# Altium schematic sheet 08_SERIAL & USER INTERF.SchDoc
size 420 x 297 mm
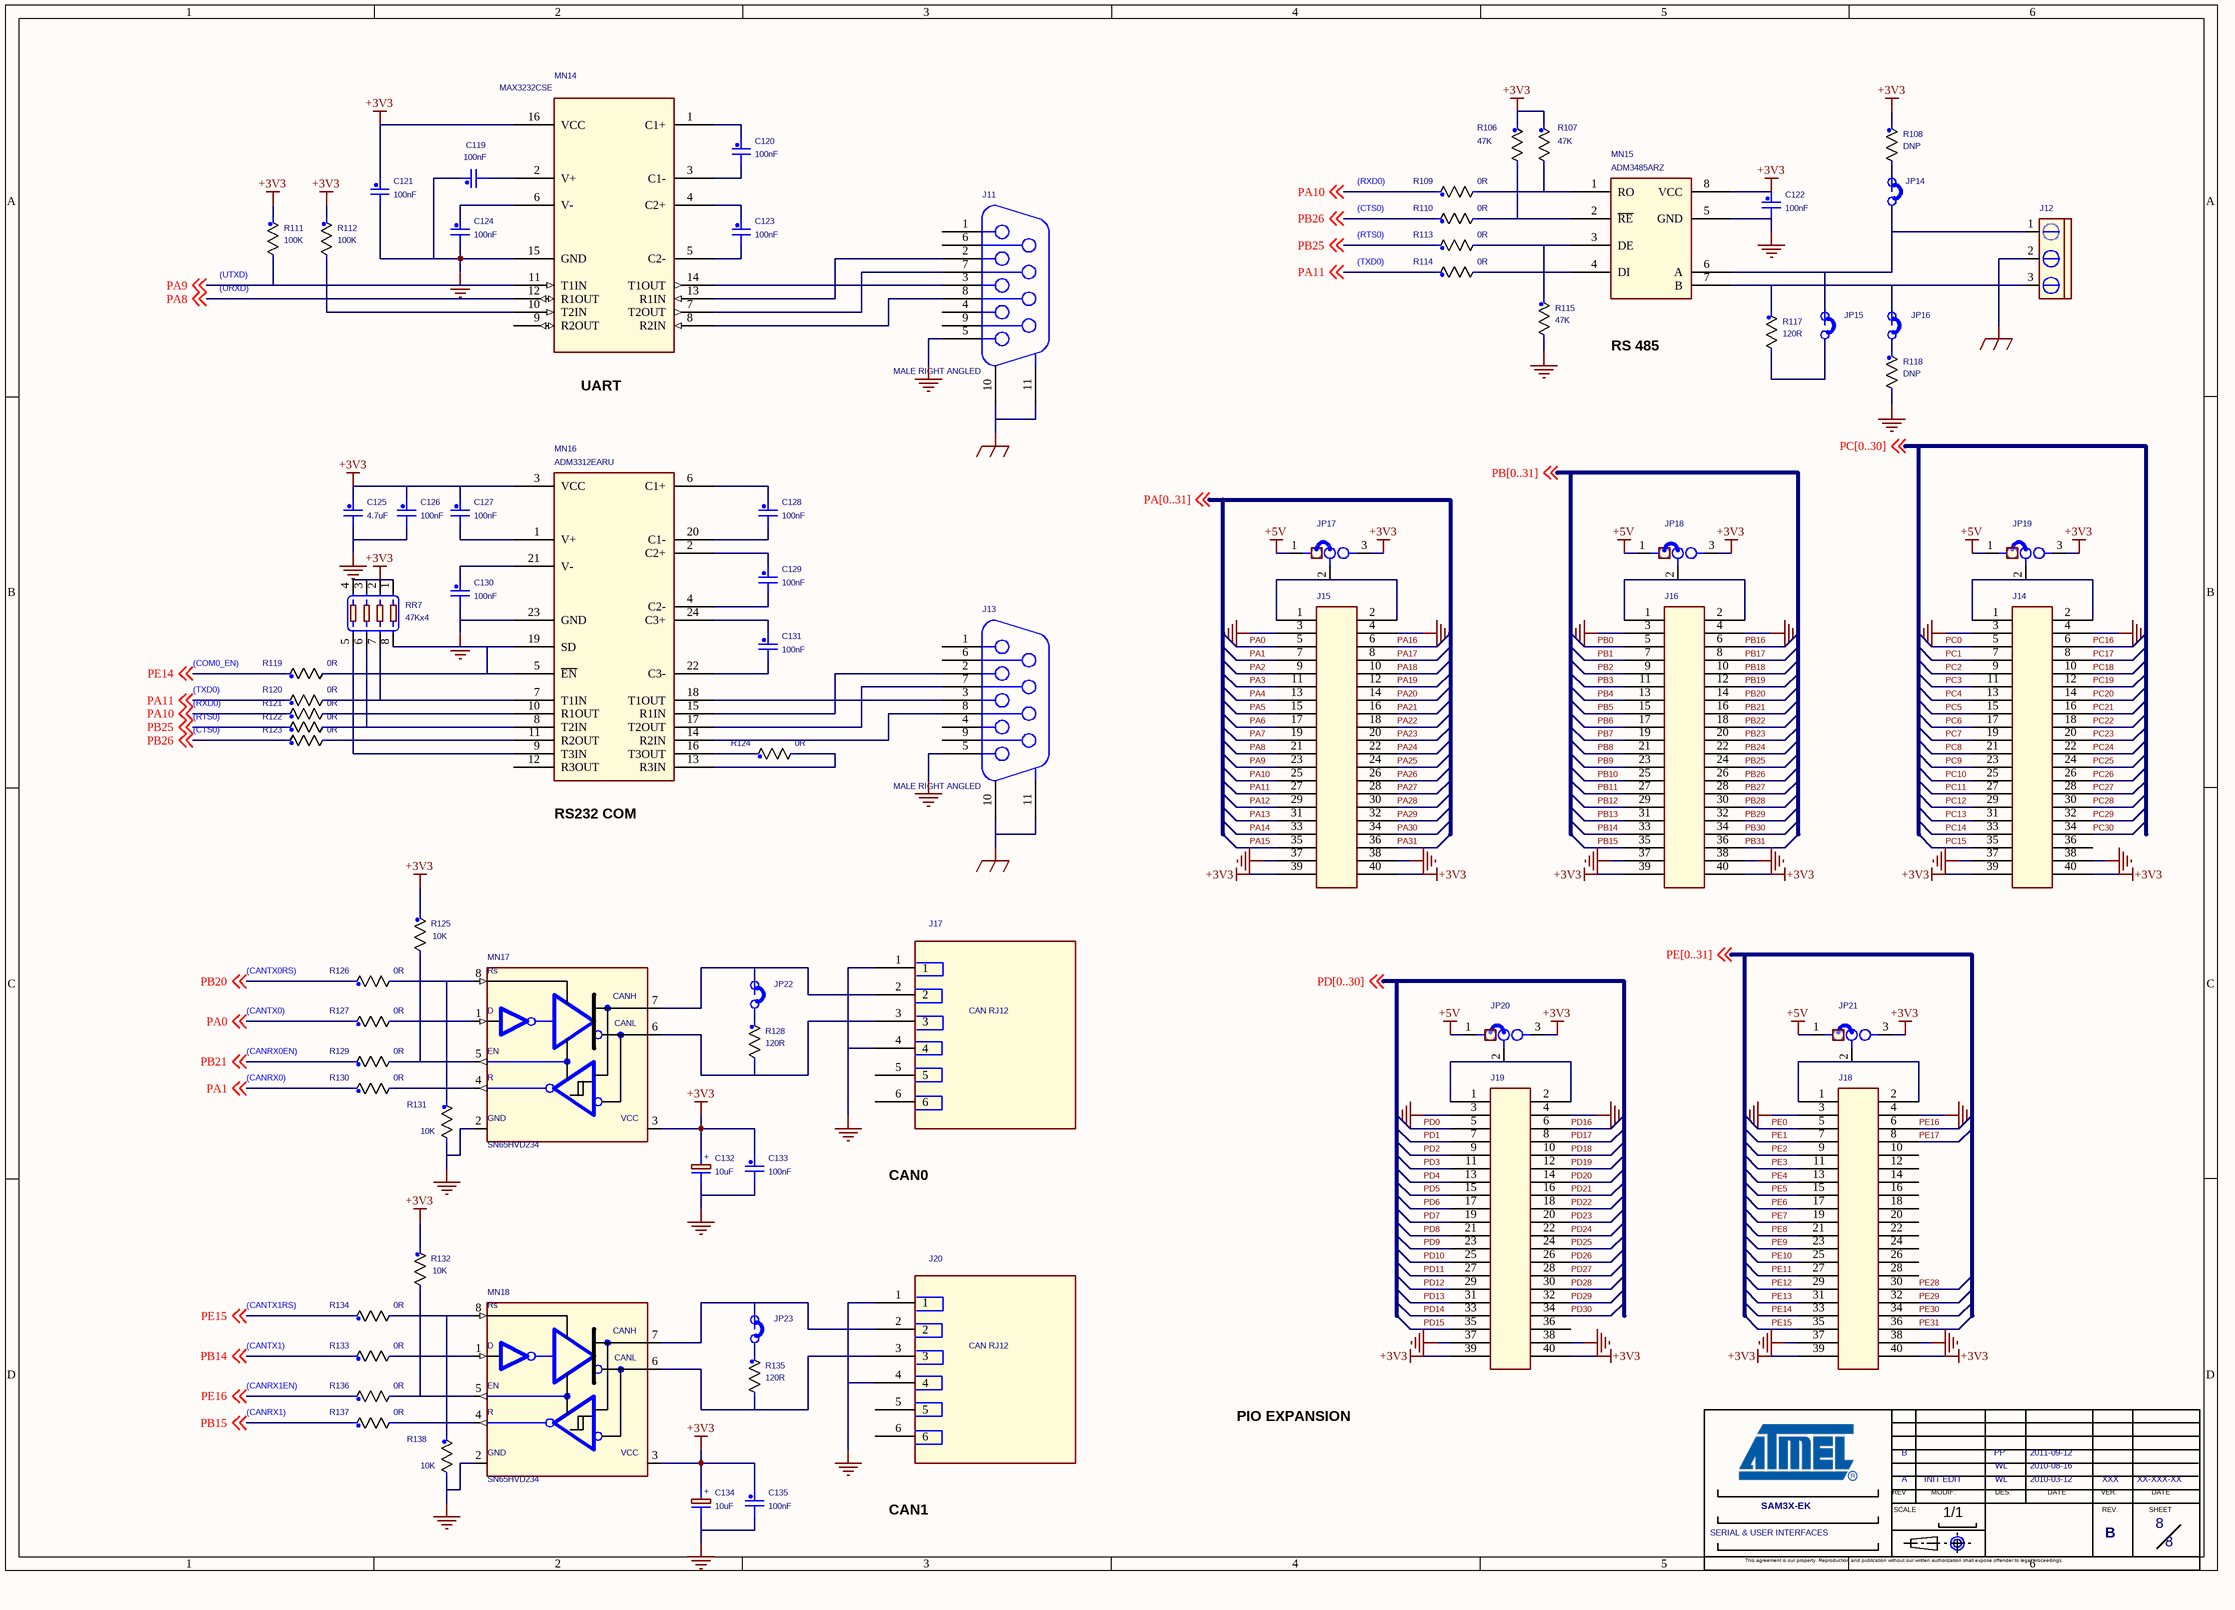
[diagram p0: 08_SERIAL & USER INTERF.SchDoc]

## Parts
*  SHEET NAME 1: SERIAL & USER INTERFACES  REV C: B  VERIF A: XXX  VERIF DATE A: XX-XXX-XX  Page Count: 8  DATE A: 2010-03-12  DATE B: 2010-08-16  DATE C: 2011-09-12  DES A: WL  DES C: PP  BOARD NAME: SAM3X-EK  VERSION: A  MODIF. DESCRIBE: INIT EDIT  (hidden comment: ATMEL ARM)  (graphical)
C119  100nF  [CAP0805]
C120  100nF  [CAP0805]
C121  100nF  [CAP0805]
C122  100nF  [CAP0805]
C123  100nF  [CAP0805]
C124  100nF  [CAP0805]
C125  4.7uF  [CAP0805]
C126  100nF  [CAP0805]
C127  100nF  [CAP0805]
C128  100nF  [CAP0805]
C129  100nF  [CAP0805]
C130  100nF  [CAP0805]
C131  100nF  [CAP0805]
C132  10uF  [C3216-18]
C133  100nF  [CAP0805]
C134  10uF  [C3216-18]
C135  100nF  [CAP0805]
J11  VAL: MALE RIGHT ANGLED  [SUBD9M_H_C]  (hidden comment: SUBD9_M_COUDE)
J12  7143-035S  [7143-035s]  (value not drawn)
J13  VAL: MALE RIGHT ANGLED  [SUBD9M_H_C]  (hidden comment: SUBD9_M_COUDE)
J14  048  [jms_tsm-2x20pts]  (value not drawn)
J15  048  [jms_tsm-2x20pts]  (value not drawn)
J16  048  [jms_tsm-2x20pts]  (value not drawn)
J17  CAN RJ12  [RJ12-55503]
J18  048  [jms_tsm-2x20pts]  (value not drawn)
J19  048  [jms_tsm-2x20pts]  (value not drawn)
J20  CAN RJ12  [RJ12-55503]
JP14  JP  [BAR2PTS02]  (value not drawn)
JP15  JP  [BAR2PTS02]  (value not drawn)
JP16  JP  [BAR2PTS02]  (value not drawn)
JP17  header3-100  [BAR3PTS02]  (value not drawn)
JP18  header3-100  [BAR3PTS02]  (value not drawn)
JP19  header3-100  [BAR3PTS02]  (value not drawn)
JP20  header3-100  [BAR3PTS02]  (value not drawn)
JP21  header3-100  [BAR3PTS02]  (value not drawn)
JP22  JP  [BAR2PTS02]  (value not drawn)
JP23  JP  [BAR2PTS02]  (value not drawn)
MN14  MAX3232CSE  [so16]
MN15  ADM3485ARZ  [so8]
MN16  ADM3312EARU  [tssop24]
MN17  SN65HVD234  [SO08]
MN18  SN65HVD234  [SO08]
R106  47K  [R0603]
R107  47K  [R0603]
R108  DNP  [r0603]
R109  0R  [r0603]
R110  0R  [r0603]
R111  100K  [r0603]
R112  100K  [r0603]
R113  0R  [r0603]
R114  0R  [r0603]
R115  47K  [R0603]
R117  120R  [r0603]
R118  DNP  [r0603]
R119  0R  [r0603]
R120  0R  [r0603]
R121  0R  [r0603]
R122  0R  [r0603]
R123  0R  [r0603]
R124  0R  [r0603]
R125  10K  [R0603]
R126  0R  [r0603]
R127  0R  [r0603]
R128  120R  [r0603]
R129  0R  [r0603]
R130  0R  [r0603]
R131  10K  [R0603]
R132  10K  [R0603]
R133  0R  [r0603]
R134  0R  [r0603]
R135  120R  [r0603]
R136  0R  [r0603]
R137  0R  [r0603]
R138  10K  [R0603]
RR7  47Kx4  [RESP4R]
SH20  Jumper Pitch 2.54  [JUMPER-2.54]  (value not drawn)
SH21  Jumper Pitch 2.54  [JUMPER-2.54]  (value not drawn)
SH22  Jumper Pitch 2.54  [JUMPER-2.54]  (value not drawn)
SH23  Jumper Pitch 2.54  [JUMPER-2.54]  (value not drawn)
SH24  Jumper Pitch 2.54  [JUMPER-2.54]  (value not drawn)
SH25  Jumper Pitch 2.54  [JUMPER-2.54]  (value not drawn)
SH26  Jumper Pitch 2.54  [JUMPER-2.54]  (value not drawn)
SH27  Jumper Pitch 2.54  [JUMPER-2.54]  (value not drawn)
SH28  Jumper Pitch 2.54  [JUMPER-2.54]  (value not drawn)
SH29  Jumper Pitch 2.54  [JUMPER-2.54]  (value not drawn)

## Nets
+3V3: C121.1 C122.1 C125.1 C126.1 C127.1 C132.1 C133.1 C134.1 C135.1 J14.39 J14.40 J15.39 J15.40 J16.39 J16.40 J18.39 J18.40 J19.39 J19.40 JP17.3 JP18.3 JP19.3 JP20.3 JP21.3 MN14.16(VCC) MN15.8(VCC) MN16.3(VCC) MN17.3(VCC) MN18.3(VCC) R106.1 R107.1 R108.1 R111.1 R112.1 R125.1 R132.1 RR7.1 RR7.2 RR7.3 RR7.4
+5V: JP17.1 JP18.1 JP19.1 JP20.1 JP21.1
GND_EARTH: J11.10(M1) J11.11(M2) J12.2 J13.10(M1) J13.11(M2)
GND_POWER: C119.1 C121.2 C122.2 C124.2 C125.2 C126.2 C130.2 C132.2 C133.2 C134.2 C135.2 J11.5 J13.5 J14.3 J14.4 J14.37 J14.38 J15.3 J15.4 J15.37 J15.38 J16.3 J16.4 J16.37 J16.38 J17.1 J17.4 J18.3 J18.4 J18.37 J18.38 J19.3 J19.4 J19.37 J19.38 J20.1 J20.4 MN14.15(GND) MN15.5(GND) MN16.23(GND) MN17.2(GND) MN18.2(GND) R115.2 R118.2 R131.2 R138.2
PA0: J15.5 R127.1 ; off-sheet PA0
PA1: J15.7 R130.1 ; off-sheet PA1
PA2: J15.9
PA3: J15.11
PA4: J15.13
PA5: J15.15
PA6: J15.17
PA7: J15.19
PA8: J15.21 MN14.12(R1OUT) ; off-sheet PA8
PA9: J15.23 MN14.11(T1IN) R111.2 ; off-sheet PA9
PA10: J15.25 R109.1 R121.1 ; off-sheet PA10
PA11: J15.27 R114.1 R120.1 ; off-sheet PA11
PA12: J15.29
PA13: J15.31
PA14: J15.33
PA15: J15.35
PA16: J15.6
PA17: J15.8
PA18: J15.10
PA19: J15.12
PA20: J15.14
PA21: J15.16
PA22: J15.18
PA23: J15.20
PA24: J15.22
PA25: J15.24
PA26: J15.26
PA27: J15.28
PA28: J15.30
PA29: J15.32
PA30: J15.34
PA31: J15.36
PB0: J16.5
PB1: J16.7
PB2: J16.9
PB3: J16.11
PB4: J16.13
PB5: J16.15
PB6: J16.17
PB7: J16.19
PB8: J16.21
PB9: J16.23
PB10: J16.25
PB11: J16.27
PB12: J16.29
PB13: J16.31
PB14: J16.33 R133.1 ; off-sheet PB14
PB15: J16.35 R137.1 ; off-sheet PB15
PB16: J16.6
PB17: J16.8
PB18: J16.10
PB19: J16.12
PB20: J16.14 R126.1 ; off-sheet PB20
PB21: J16.16 R129.1 ; off-sheet PB21
PB22: J16.18
PB23: J16.20
PB24: J16.22
PB25: J16.24 R113.1 R122.1 ; off-sheet PB25
PB26: J16.26 R110.1 R123.1 ; off-sheet PB26
PB27: J16.28
PB28: J16.30
PB29: J16.32
PB30: J16.34
PB31: J16.36
PC0: J14.5
PC1: J14.7
PC2: J14.9
PC3: J14.11
PC4: J14.13
PC5: J14.15
PC6: J14.17
PC7: J14.19
PC8: J14.21
PC9: J14.23
PC10: J14.25
PC11: J14.27
PC12: J14.29
PC13: J14.31
PC14: J14.33
PC15: J14.35
PC16: J14.6
PC17: J14.8
PC18: J14.10
PC19: J14.12
PC20: J14.14
PC21: J14.16
PC22: J14.18
PC23: J14.20
PC24: J14.22
PC25: J14.24
PC26: J14.26
PC27: J14.28
PC28: J14.30
PC29: J14.32
PC30: J14.34
PD0: J19.5
PD1: J19.7
PD2: J19.9
PD3: J19.11
PD4: J19.13
PD5: J19.15
PD6: J19.17
PD7: J19.19
PD8: J19.21
PD9: J19.23
PD10: J19.25
PD11: J19.27
PD12: J19.29
PD13: J19.31
PD14: J19.33
PD15: J19.35
PD16: J19.6
PD17: J19.8
PD18: J19.10
PD19: J19.12
PD20: J19.14
PD21: J19.16
PD22: J19.18
PD23: J19.20
PD24: J19.22
PD25: J19.24
PD26: J19.26
PD27: J19.28
PD28: J19.30
PD29: J19.32
PD30: J19.34
PE0: J18.5
PE1: J18.7
PE2: J18.9
PE3: J18.11
PE4: J18.13
PE5: J18.15
PE6: J18.17
PE7: J18.19
PE8: J18.21
PE9: J18.23
PE10: J18.25
PE11: J18.27
PE12: J18.29
PE13: J18.31
PE14: J18.33 R119.1 ; off-sheet PE14
PE15: J18.35 R134.1 ; off-sheet PE15
PE16: J18.6 R136.1 ; off-sheet PE16
PE17: J18.8
PE28: J18.30
PE29: J18.32
PE30: J18.34
PE31: J18.36
NetC119_2: C119.2 MN14.2(V+)
NetC120_1: C120.1 MN14.1(C1+)
NetC120_2: C120.2 MN14.3(C1-)
NetC123_1: C123.1 MN14.4(C2+)
NetC123_2: C123.2 MN14.5(C2-)
NetC124_1: C124.1 MN14.6(V-)
NetC127_2: C127.2 MN16.1(V+)
NetC128_1: C128.1 MN16.6(C1+)
NetC128_2: C128.2 MN16.20(C1-)
NetC129_1: C129.1 MN16.2(C2+)
NetC129_2: C129.2 MN16.4(C2-)
NetC130_1: C130.1 MN16.21(V-)
NetC131_1: C131.1 MN16.24(C3+)
NetC131_2: C131.2 MN16.22(C3-)
NetJ11_2: J11.2 MN14.13(R1IN)
NetJ11_3: J11.3 MN14.14(T1OUT)
NetJ11_7: J11.7 MN14.7(T2OUT)
NetJ11_8: J11.8 MN14.8(R2IN)
NetJ12_1: J12.1 JP14.2 JP15.1 MN15.6(A)
NetJ12_3: J12.3 JP16.1 MN15.7(B) R117.1
NetJ13_2: J13.2 MN16.15(R1IN)
NetJ13_3: J13.3 MN16.18(T1OUT)
NetJ13_7: J13.7 MN16.17(T2OUT)
NetJ13_8: J13.8 MN16.14(R2IN)
NetJ14_1: J14.1 J14.2 JP19.2
NetJ15_1: J15.1 J15.2 JP17.2
NetJ16_1: J16.1 J16.2 JP18.2
NetJ17_2: J17.2 JP22.1 MN17.7(CANH)
NetJ17_3: J17.3 MN17.6(CANL) R128.2
NetJ18_1: J18.1 J18.2 JP21.2
NetJ19_1: J19.1 J19.2 JP20.2
NetJ20_2: J20.2 JP23.1 MN18.7(CANH)
NetJ20_3: J20.3 MN18.6(CANL) R135.2
NetJP14_1: JP14.1 R108.2
NetJP15_2: JP15.2 R117.2
NetJP16_2: JP16.2 R118.1
NetJP22_2: JP22.2 R128.1
NetJP23_2: JP23.2 R135.1
NetMN14_10: MN14.10(T2IN) R112.2
NetMN15_1: MN15.1(RO) R107.2 R109.2
NetMN15_2: MN15.2(~{RE}) R106.2 R110.2
NetMN15_3: MN15.3(DE) R113.2 R115.1
NetMN15_4: MN15.4(DI) R114.2
NetMN16_5: MN16.5(~{EN}) MN16.19(SD) R119.2 RR7.8
NetMN16_7: MN16.7(T1IN) R120.2 RR7.7
NetMN16_8: MN16.8(T2IN) R122.2 RR7.6
NetMN16_9: MN16.9(T3IN) RR7.5
NetMN16_10: MN16.10(R1OUT) R121.2
NetMN16_11: MN16.11(R2OUT) R123.2
NetMN16_13: MN16.13(R3IN) R124.2
NetMN16_16: MN16.16(T3OUT) R124.1
NetMN17_1: MN17.1(TXD) R127.2
NetMN17_4: MN17.4(RXD) R130.2
NetMN17_5: MN17.5(VREF) R125.2 R129.2
NetMN17_8: MN17.8(RS) R126.2 R131.1
NetMN18_1: MN18.1(TXD) R133.2
NetMN18_4: MN18.4(RXD) R137.2
NetMN18_5: MN18.5(VREF) R132.2 R136.2
NetMN18_8: MN18.8(RS) R134.2 R138.1

Not connected (* = marked no-connect by the designer): J11 1 4 6 9; J13 1 4 6 9; J14 36; J17 5 6; J18 10 12 14 16 18 20 22 24 26 28; J19 36; J20 5 6; MN14 9(R2OUT); MN16 12(R3OUT)

## Notes on the sheet
- (RXD0)
- (RTS0)
- (CTS0)
- (near R111) (UTXD)
- (near R111) (URXD)
- (TXD0)
- UART
- RS 485
- (COM0_EN)
- (near MN16) RS232 COM
- (CANTX0RS)
- (CANTX0)
- (CANRX0EN)
- (CANRX0)
- CAN0
- (CANTX1RS)
- (CANRX1EN)
- (CANTX1)
- (CANRX1)
- PIO EXPANSION
- CAN1
- (in symbol ATMEL ARM) REV; MODIF.; DES.; DATE; VER.; SCALE; REV.; SHEET; 1/1; This agreement is our property. Reproduction and publication without our written authorization shall expose offender to legal proceedings.
- (in symbol CAP_PN) +
- (in symbol SN65HVD234 SO8) Rs; D; EN; R

## Library data of the parts
* = ATMEL ARM: REV D: D; REV F: F; REV E: E; REV B: B; VERIF F: XXX; VERIF E: XXX; VERIF D: XXX; VERIF C: XXX; VERIF B: XXX; VERIF DATE F: XX-XXX-XX; VERIF DATE E: XX-XXX-XX; VERIF DATE D: XX-XXX-XX; VERIF DATE C: XX-XXX-XX; REV: B; VERIF DATE B: XX-XXX-XX; FT: ?; Page Number: 8; Page Size: A; Page Create Date: june 19, 2004; DATE D: XX-XXX-XX; DATE E: XX-XXX-XX; DATE F: XX-XXX-XX; DES E: XXX; DES F: XXX; DES B: WL; DES D: XXX
C119 C121 C123 C127 C128 C131 C133 C135 = C_Generic: Toler.: 10%; P/N #1: C0603C104K4RAC; Voltage: 16V; Mfg #1: KEMET; Dielectric: X7R; REF: C1608X7R1C104KT; FAB: TDK; DEV: C0603; DESIG: Ceramic Capacitor; BOI: 0603; TOL: 10%; TEN: 16V; VAL: 100nF
C120 C122 C124 C126 C129 C130 = C_Generic: Toler.: 10%; P/N #1: C0603C104K4RAC; Voltage: 16V; Mfg #1: KEMET; Dielectric: X7R; BOI: 0603; DESIG: Ceramic Capacitor; DEV: C0603; FAB: TDK; REF: C1608X7R1C104KT; VAL: 100nF; TEN: 16V; TOL: 10%
C125 = C_Generic: Toler.: 10%; P/N #1: C0603C104K4RAC; Voltage: 16V; Mfg #1: KEMET; Dielectric: X5R; BOI: 0805; DESIG: X5R CERAMIC CAPACITOR; DEV: C0805; FAB: TDK; REF: C2012X5R1C475KT; VAL: 4.7uF; TEN: 16V; TOL: 10%
C132 C134 = CAP_PN: SDTSourceLibName: C:\WINDOWS\TEMP\SNDS.LIB; BOI: A; DESIG: LOW ESR TANTALUM CAPACITOR; DEV: 3216; FAB: AVX; REF: TPSA106K010R1800; TEN: 10V; TOL: 10%; Dielectric: X5R; VAL: 10uF
J11 J13 = SUBD9_M_COUDE: DESIG: D-SUB 9  RIGHT ANGLED MALE; FAB: leyconn; REF: 021000014; DEV: SUBD9M_H_C
J12 = MKDS 1/3-3.81: FAB: LEYCO; DESIG: 3 Positions, 5.0 mm pitch Printed circuit terminal block; DEV: TBT_MKDS1-3X3-81_01; VAL: 7143-035S; REF: 7143-035S
J14 J16 = SDIC40_2.54mm: DESIG: 2.54mm Pin Header,Dual Row,S.M.T; FAB: SHENZHEN SITUO; REF: 048; VAL: 048
J15 J18 J19 = SDIC40_2.54mm: FAB: SHENZHEN SITUO; DESIG: 2.54mm Pin Header,Dual Row,S.M.T; VAL: 048; REF: 048
J17 J20 = RJ12-6: FAB: leyconn; VAL: 55503; REF: 55503
JP14-JP16 JP22 JP23 = JUMP_0: DESIG: 2.54mm Pin Header,Single Row,Straight/Right Angle(2pin); FAB: SHENZHEN SITUO; REF: 045; VAL: 045
JP17-JP21 = TSW 3PTS-DROIT_0: DESIG: Single Row Terminal Strips; BOI: TSW; FAB: SAMTEC; RoHS: YES; DEV: HEADER3-100; REF: header3-100; VAL: header3-100; PN: header3-100
MN14 = max232: FAB: MAXIM; DESIG: Tranceiver RS232; VAL: MAX3232CSE; REF: MAX3232CSE; DEV: SO16; BOI: SO16
MN15 = ADM3394: FAB: ADI; DESIG: Half-Duplex RS-485 Transceiver; BOI: SOIC8; Val: ADM3485ARZ; REF: ADM3485ARZ
MN16 = ADM3312E: FAB: ADI; DESIG: Serial Port Tranceiver; BOI: TSSOP24; REF: ADM3312EARU; Val: ADM3312EARU
MN17 MN18 = SN65HVD234 SO8: FAB: TI; BOI: SO8; DESIG: 3.3V CAN TRANCEIVER; REF: SN65HVD234D; VAL: SN65HVD234; DEV: SO08
R106 R107 = R_Generic: P/N #1: CR10-1001F-T; BOI: 0603; DESIG: RC21 5%; FAB: YAGEO; REF: RC0603JR-0747KL; TOL: 5%; DEV: R0603; VAL: 47K
R108 = R_Generic: P/N #1: CR10-1001F-T; TOL: 5%; VAL: NOT POPULATED; FAB: YAGEO; DESIG: RC21 5%; BOI: 0603; DEV: R0603
R109 R110 R114 R124 R126 R127 R130 R133 R134 R137 = R_Generic: P/N #1: CR10-1001F-T; TOL: 5%; REF: RC0603JR-070RL; FAB: YAGEO; DESIG: RC21 5%; BOI: 0603; VAL: 0R; DEV: R0603
R111 = R_Generic: P/N #1: CR10-1001F-T; TOL: 5%; REF: RC0603JR-07100KL; FAB: YAGEO; DESIG: RC21 5%; BOI: 0603; VAL: 100K; DEV: R0603
R112 = R_Generic: P/N #1: CR10-1001F-T; BOI: 0603; DESIG: RC21 5%; FAB: YAGEO; REF: RC0603JR-07100KL; TOL: 5%; DEV: R0603; VAL: 100K
R113 R119-R123 R129 R136 = R_Generic: P/N #1: CR10-1001F-T; BOI: 0603; DESIG: RC21 5%; FAB: YAGEO; REF: RC0603JR-070RL; TOL: 5%; DEV: R0603; VAL: 0R
R115 = R_Generic: P/N #1: CR10-1001F-T; TOL: 5%; REF: RC0603JR-0747KL; FAB: YAGEO; DESIG: RC21 5%; BOI: 0603; VAL: 47K; DEV: R0603
R117 = R_Generic: P/N #1: CR10-1001F-T; BOI: 0603; DESIG: RC21 5%; FAB: YAGEO; REF: RC0603JR-07120RL; TOL: 5%; DEV: R0603; VAL: 120R
R118 = R_Generic: P/N #1: CR10-1001F-T; BOI: 0603; DESIG: RC21 5%; FAB: YAGEO; VAL: NOT POPULATED; TOL: 5%; DEV: R0603
R125 R131 R132 R138 = R_Generic: P/N #1: CR10-1001F-T; TOL: 5%; REF: RC0603JR-0710KL; FAB: YAGEO; DESIG: RC21 5%; BOI: 0603; VAL: 10K; DEV: R0603
R128 R135 = R_Generic: P/N #1: CR10-1001F-T; TOL: 5%; REF: RC0603JR-07120RL; FAB: YAGEO; DESIG: RC21 5%; BOI: 0603; VAL: 120R; DEV: R0603
RR7 = RES_ARRAY: TOL: 5%; REF: YC124JR-0747K; FAB: YAGEO; DESIG: Chip Resistor Arrays; BOI: YC124; VAL: 47Kx4
SH20-SH22 SH26 SH29 = JUMPER-2.54: Jumper,2 Points Jumper Pitch 2.54; Part Number: 440-00002-1; Manufacturer: WIESON; Manufacturer Part Number: G4160-1A60BF1U; FAB: NA; REF: JUMPER 2.54; DESIG: 2 POINTS JUMPER PITCH 2.54; VAL: JUMPER 2.54; BOI: NA; Part Type: Jumper
SH23-SH25 SH27 SH28 = JUMPER-2.54: Jumper,2 Points Jumper Pitch 2.54; Manufacturer Part Number: G4160-1A60BF1U; Manufacturer: WIESON; Part Number: 440-00002-1; FAB: NA; REF: JUMPER 2.54; DESIG: 2 POINTS JUMPER PITCH 2.54; VAL: JUMPER 2.54; BOI: NA; Part Type: Jumper